# Altium schematic sheet PERIPH.SchDoc
size A4
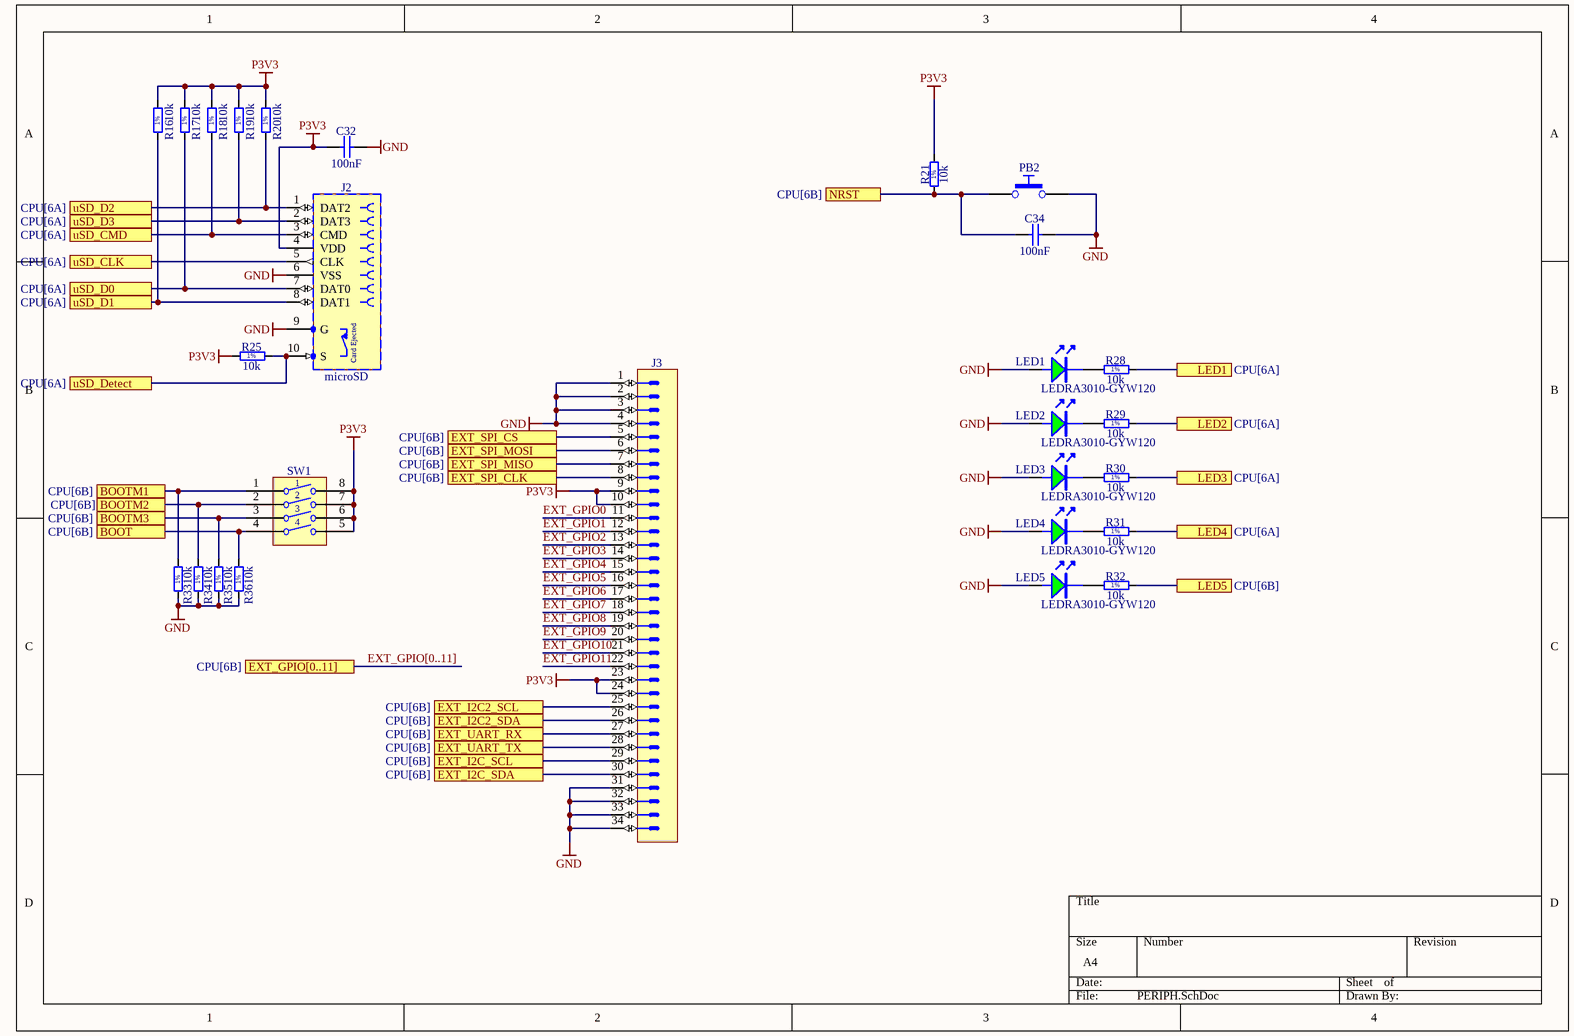
[diagram p0: PERIPH.SchDoc]

## Parts
C32  100nF  [CAPC1005X55N]
C34  100nF  [CAPC1005X55N]
J2  microSD  [ATTEND_112A-TAAR-R03]
J3  Header 34  [3M_N2534-6002RB]  (value not drawn)
LED1  LEDRA3010-GYW120  [LED_KPA3010_G]
LED2  LEDRA3010-GYW120  [LED_KPA3010_G]
LED3  LEDRA3010-GYW120  [LED_KPA3010_G]
LED4  LEDRA3010-GYW120  [LED_KPA3010_G]
LED5  LEDRA3010-GYW120  [LED_KPA3010_G]
PB2  Push Button  [PB_TYCO_FSMSM]  (value not drawn)
R16  10k  [RESC1005X40N]
R17  10k  [RESC1005X40N]
R18  10k  [RESC1005X40N]
R19  10k  [RESC1005X40N]
R20  10k  [RESC1005X40N]
R21  10k  [RESC1005X40N]
R25  10k  [RESC1005X40N]
R28  10k  [RESC1005X40N]
R29  10k  [RESC1005X40N]
R30  10k  [RESC1005X40N]
R31  10k  [RESC1005X40N]
R32  10k  [RESC1005X40N]
R33  10k  [RESC1005X40N]
R34  10k  [RESC1005X40N]
R35  10k  [RESC1005X40N]
R36  10k  [RESC1005X40N]
SW1  Switch  [SW_CTS_219-4MST]  (value not drawn)

## Ports
BOOT (see CPU[6B]), BOOTM1 (see CPU[6B]), BOOTM2 (see CPU[6B]), BOOTM3 (see CPU[6B]), EXT_GPIO[0..11] (see CPU[6B]), EXT_I2C2_SCL (see CPU[6B]), EXT_I2C2_SDA (see CPU[6B]), EXT_I2C_SCL (see CPU[6B]), EXT_I2C_SDA (see CPU[6B]), EXT_SPI_CLK (see CPU[6B]), EXT_SPI_CS (see CPU[6B]), EXT_SPI_MISO (see CPU[6B]), EXT_SPI_MOSI (see CPU[6B]), EXT_UART_RX (see CPU[6B]), EXT_UART_TX (see CPU[6B]), LED1 (see CPU[6A]), LED2 (see CPU[6A]), LED3 (see CPU[6A]), LED4 (see CPU[6A]), LED5 (see CPU[6B]), NRST (see CPU[6B]), uSD_CLK (see CPU[6A]), uSD_CMD (see CPU[6A]), uSD_D0 (see CPU[6A]), uSD_D1 (see CPU[6A]), uSD_D2 (see CPU[6A]), uSD_D3 (see CPU[6A]), uSD_Detect (see CPU[6A])

## Nets
GND: C32.2 C34.2 J2.6(VSS) J2.9(G) J3.1 J3.2 J3.3 J3.4 J3.31 J3.32 J3.33 J3.34 LED1.A LED2.A LED3.A LED4.A LED5.A PB2.2 R33.1 R34.1 R35.1 R36.1
P3V3: C32.1 J2.4(VDD) J3.9 J3.10 J3.23 J3.24 R16.2 R17.2 R18.2 R19.2 R20.2 R21.2 R25.2 SW1.5 SW1.6 SW1.7 SW1.8
BOOT: R36.2 SW1.4 ; port BOOT
BOOTM1: R33.2 SW1.1 ; port BOOTM1
BOOTM2: R34.2 SW1.2 ; port BOOTM2
BOOTM3: R35.2 SW1.3 ; port BOOTM3
EXT_GPIO0: J3.11
EXT_GPIO1: J3.12
EXT_GPIO2: J3.13
EXT_GPIO3: J3.14
EXT_GPIO4: J3.15
EXT_GPIO5: J3.16
EXT_GPIO6: J3.17
EXT_GPIO7: J3.18
EXT_GPIO8: J3.19
EXT_GPIO9: J3.20
EXT_GPIO10: J3.21
EXT_GPIO11: J3.22
EXT_I2C2_SCL: J3.25 ; port EXT_I2C2_SCL
EXT_I2C2_SDA: J3.26 ; port EXT_I2C2_SDA
EXT_I2C_SCL: J3.29 ; port EXT_I2C_SCL
EXT_I2C_SDA: J3.30 ; port EXT_I2C_SDA
EXT_SPI_CLK: J3.8 ; port EXT_SPI_CLK
EXT_SPI_CS: J3.5 ; port EXT_SPI_CS
EXT_SPI_MISO: J3.7 ; port EXT_SPI_MISO
EXT_SPI_MOSI: J3.6 ; port EXT_SPI_MOSI
EXT_UART_RX: J3.27 ; port EXT_UART_RX
EXT_UART_TX: J3.28 ; port EXT_UART_TX
LED1: R28.2 ; port LED1
LED2: R29.2 ; port LED2
LED3: R30.2 ; port LED3
LED4: R31.2 ; port LED4
LED5: R32.2 ; port LED5
NRST: C34.1 PB2.1 R21.1 ; port NRST
uSD_CLK: J2.5(CLK) ; port uSD_CLK
uSD_CMD: J2.3(CMD) R18.1 ; port uSD_CMD
uSD_D0: J2.7(DAT0) R17.1 ; port uSD_D0
uSD_D1: J2.8(DAT1) R16.1 ; port uSD_D1
uSD_D2: J2.1(DAT2) R20.1 ; port uSD_D2
uSD_D3: J2.2(DAT3) R19.1 ; port uSD_D3
uSD_Detect: J2.10(S) R25.1 ; port uSD_Detect
NetLED1_K: LED1.K R28.1
NetLED2_K: LED2.K R29.1
NetLED3_K: LED3.K R30.1
NetLED4_K: LED4.K R31.1
NetLED5_K: LED5.K R32.1

## Buses and harness runs
bus EXT_GPIO[0..11] = port EXT_GPIO[0..11]

## Notes on the sheet
- (in symbol ATTEND_112A-TAAR-R03) Card Ejected
- (in symbol R0402_10K_1%_0.0625W_100PPM) 1%

## Library data of the parts
C32 C34 = CC0402_100NF_16V_10%_X5R: Non-polarised capacitor; Part Description: SMD Multilayer Chip Ceramic Capacitor; Manufacturer: GENERIC; Manufacturer1 Part Number: GRM155R61C104KA88D; Voltage: 16V; TC: X5R; Tolerance: ±10%; Part Number: CC0402_100NF_16V_10%_X5R; Component Kind: Standard; Component Type: Standard; Pin Count: 2; Value: 100nF; Status: None; Manufacturer Part Number: CC0402_100NF_16V_10%_X5R; Case: 0402; Mounted: Yes; Socket: No; SMD: Yes; Sense: No; Manufacturer1 Example: MURATA; Manufacturer1 ComponentHeight: 0.55mm; HelpURL: \\cern.ch\dfs\Applications\Altium\Datasheets\CC0402_X5R_MURATA_GRM.pdf; Author: CERN DEM JLC; CreateDate: 2013-12-10; LatestRevisionDate: 2013-12-10
J2 = ATTEND_112A-TAAR-R03: Connector MicroSD 8 Pin + Switch; Part Description: MicroSD Socket, Push-Push Type; Manufacturer: ATTEND; PressFit: No; Part Number: ATTEND_112A-TAAR-R03; Component Kind: Standard; Component Type: Standard; Pin Count: 10; Family: microSD; Mounted: Yes; Socket: No; SMD: Yes; Sense: No; Status: None; Manufacturer Part Number: 112A-TAAR-R03; ComponentHeight: 1.9mm; HelpURL: \\cern.ch\dfs\Applications\Altium\Datasheets\ATTEND_112A-TAAR-R03.pdf; Author: CERN DEM JMW; CreateDate: 2015-07-07; LatestRevisionDate: 2015-07-07
J3 = 3M_N2534-6002RB: Connector 34 Male; Part Description: 34 Contacts - Straight .100'' x .100'' Low Profile Four-Wall Header, 2500 Series; Manufacturer: 3M; PressFit: No; Part Number: 3M_N2534-6002RB; Component Kind: Standard; Component Type: Standard; Pin Count: 34; Family: Header 34; Mounted: Yes; Socket: No; SMD: No; Sense: No; Status: None; Manufacturer Part Number: N2534-6002RB; ComponentHeight: 10.03mm; HelpURL: \\cern.ch\dfs\Applications\Altium\Datasheets\3M_N2534-6002RB.pdf; Author: CERN DEM JLC; CreateDate: 2009-02-11; LatestRevisionDate: 2009-08-11
LED1-LED5 = LED_SMD_90deg_G: LED (Maritex); Supplier 1: Farnell; Supplier Part Number 1: 8530335RL
PB2 = PB_TYCO_FSMSM: Push-Button Switch SPDT; Part Description: 12VDC 50mA SPST Tactile  Push-Button Switch; Manufacturer: TYCO ELECTRONICS; Manufacturer Part Number: FSMSM or 1437566-3; PressFit: No; Part Number: PB_TYCO_FSMSM; Component Kind: Standard; Component Type: Standard; Pin Count: 2; PackageDescription: Body 3.5x6.0mm, Pushbutton Switch,  TYCO ALCOSWITCH FSMSM Serie; Family: Push Button; Mounted: Yes; Socket: No; SMD: Yes; Sense: No; Status: None; ComponentHeight: 4.3mm; HelpURL: \\cern.ch\dfs\Applications\Altium\Datasheets\PB_TYCO_FSMSM.pdf; Author: CERN DEM JLC; CreateDate: 30.06.2008; LatestRevisionDate: 21.06.2012
R16-R21 R25 R28-R36 = R0402_10K_1%_0.0625W_100PPM: Resistor - 1%; Part Description: General Purpose Thick Film Chip Resistor; Manufacturer: GENERIC; Manufacturer1 Part Number: 232270671003L; TC: ±100ppm/°C; PressFit: No; Part Number: R0402_10K_1%_0.0625W_100PPM; Component Kind: Standard; Component Type: Standard; Pin Count: 2; Value: 10k; Status: Not Recommended; Power: 0.0625W; Tolerance: ±1%; Manufacturer Part Number: R0402_10K_1%_0.0625W_100PPM; Case: 0402; Mounted: Yes; Sense: No; Socket: No; SMD: Yes; Manufacturer1 Example: YAGEO PHYCOMP; Manufacturer1 ComponentHeight: 0.4mm; HelpURL: \\cern.ch\dfs\Applications\Altium\Datasheets\R0402_Phycomp_RC0402.pdf; Author: CERN DEM JLC; CreateDate: 2007-12-03; LatestRevisionDate: 2012-10-17
SW1 = SW_CTS_219-4MST: 4 Ways SPST DIP Switch; Part Description: 4 Ways, Pitch 2.54mm, SPST DIP Switch, Rating 100mA 50VDC; Manufacturer: CTS ELECTROCOMPONENTS; PressFit: No; Part Number: SW_CTS_219-4MST; Component Kind: Standard; Component Type: Standard; Pin Count: 8; PackageDescription: Pitch 2.54mm, Body 6.7 x 11.63mm, 4 Ways SPST Surface-Mounting DIP Switch, CTS 219 Series; Family: Switch; Mounted: Yes; Socket: No; SMD: Yes; Sense: No; Status: None; Manufacturer Part Number: 219-4MST; ComponentHeight: 2.23mm; HelpURL: \\cern.ch\dfs\Applications\Altium\Datasheets\SW_CTS_219-4MST.pdf; Author: CERN DEM JLC; CreateDate: 2014-11-17; LatestRevisionDate: 2014-11-17